# Altium schematic sheet PEAK——LCW (1).SchDoc
size A2
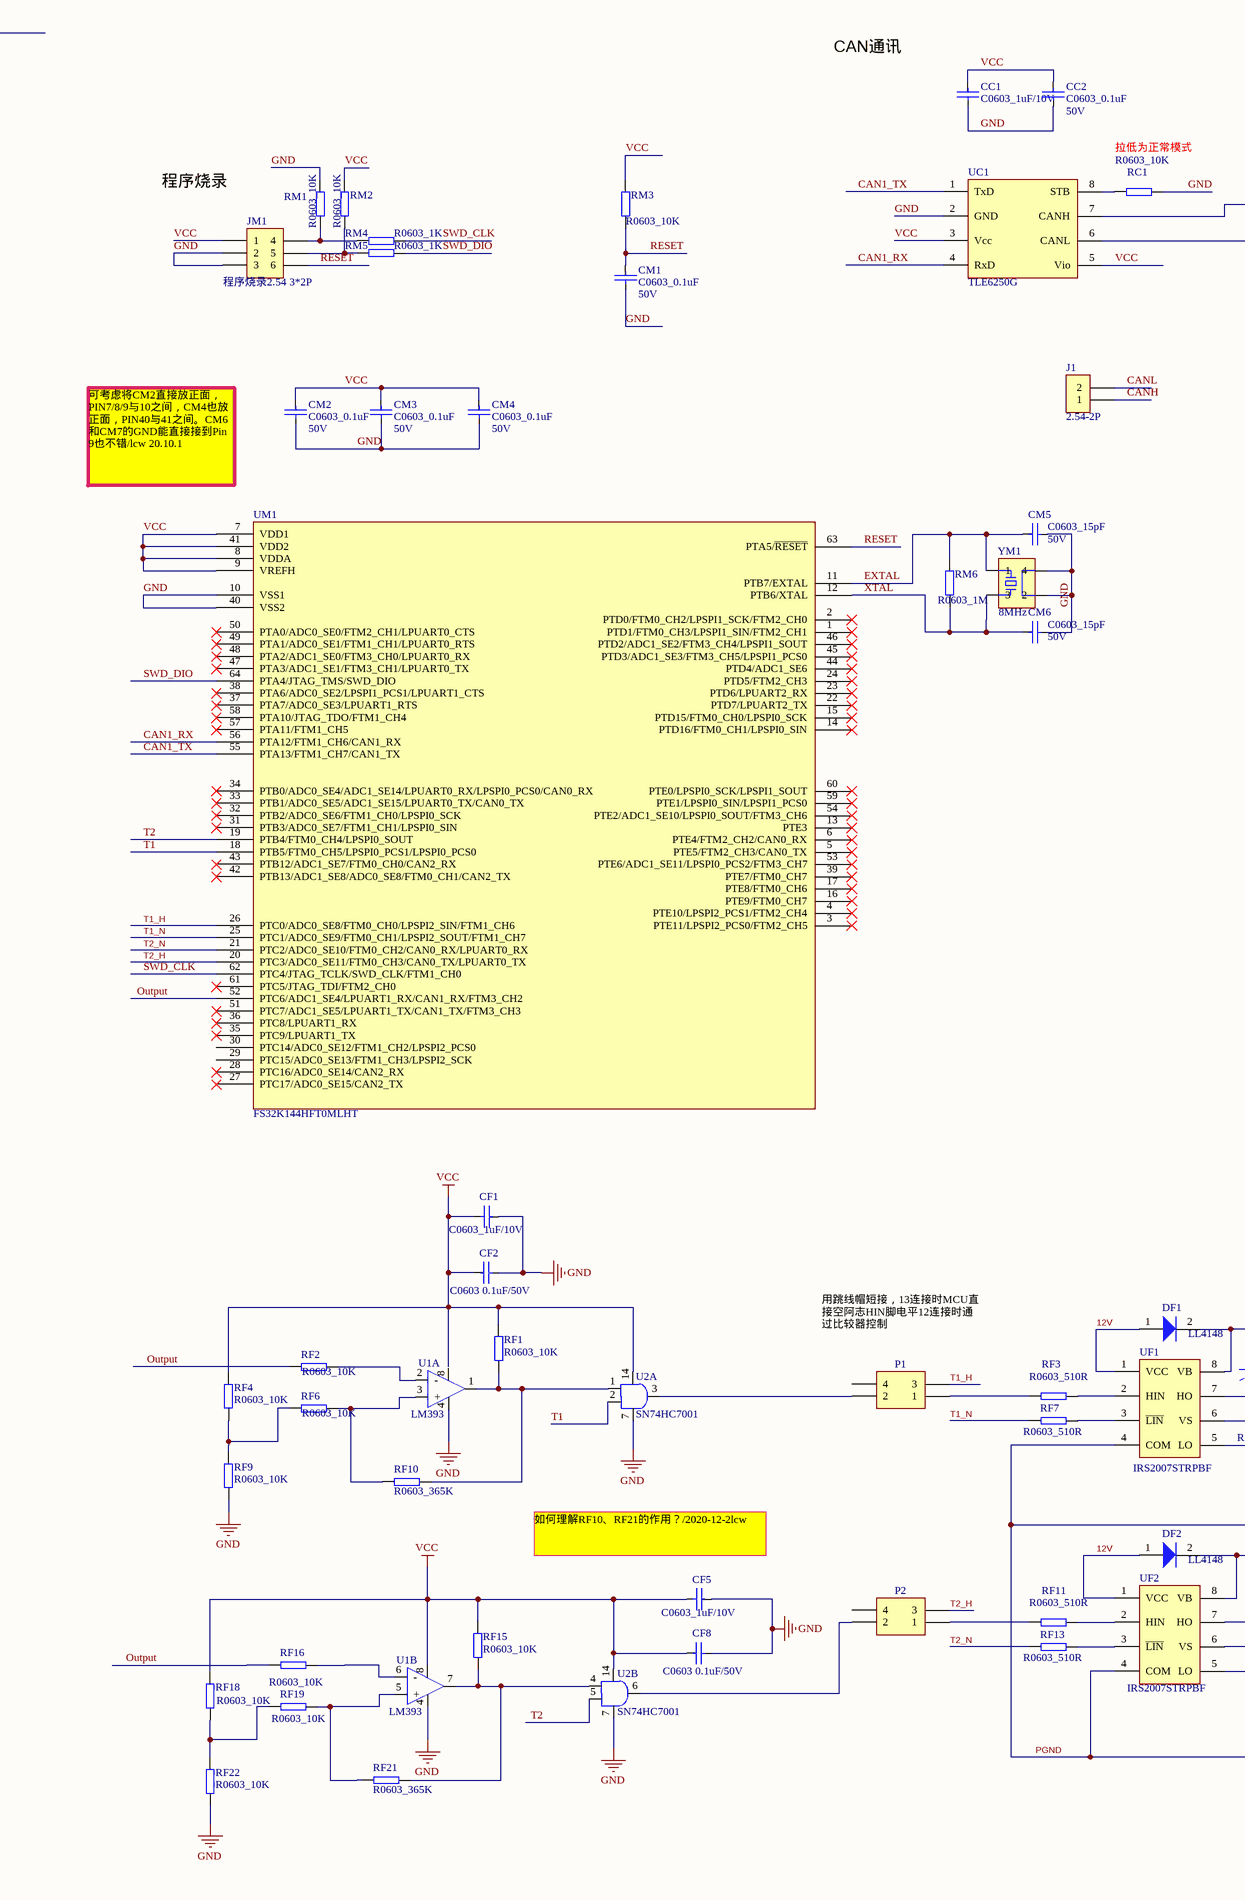
[diagram p0: PEAK——LCW (1).SchDoc, left]
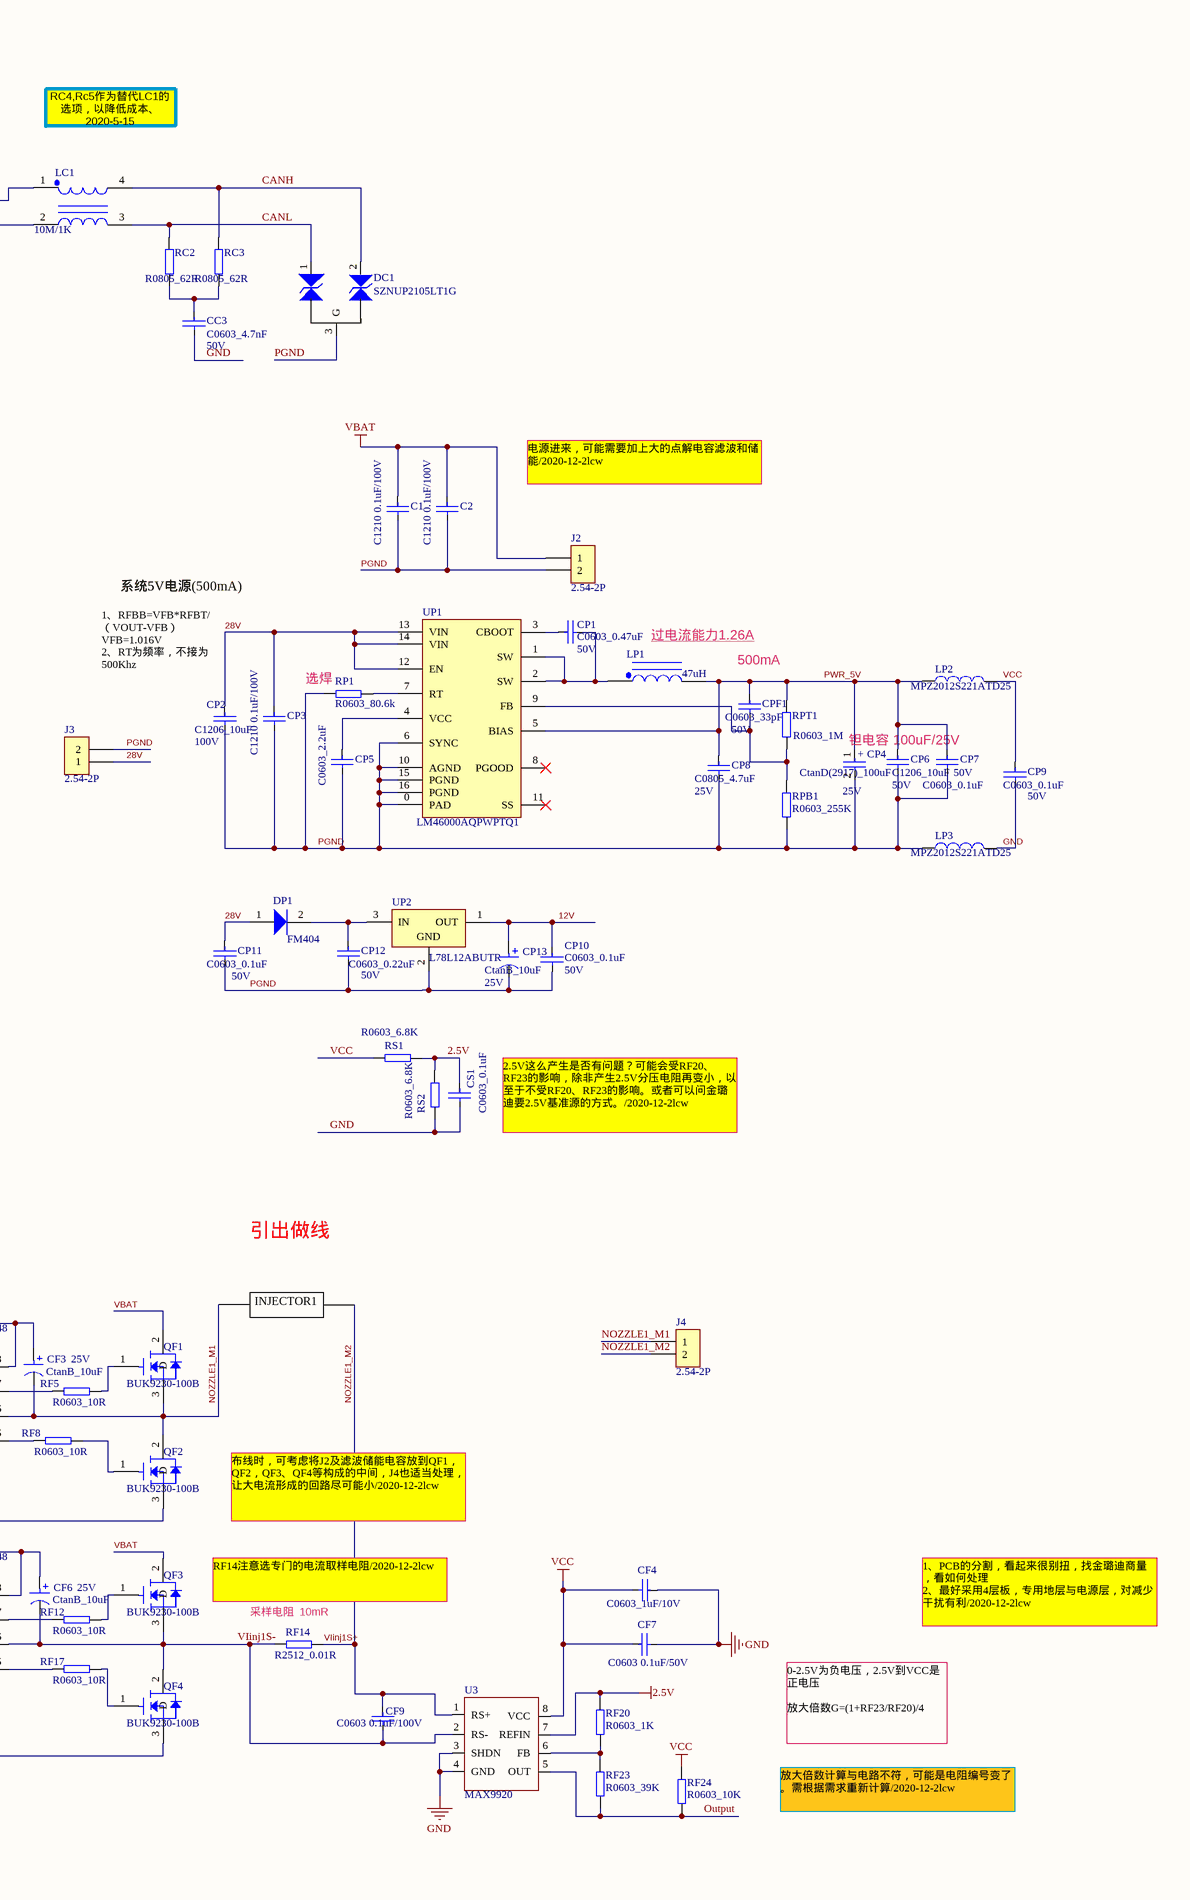
[diagram p1: PEAK——LCW (1).SchDoc, right]

## Parts
C1  C1210 0.1uF/100V  [C1210]
C2  C1210 0.1uF/100V  [C1210]
CC1  C0603_1uF/10V  [C0603]
CC2  Voltage: 50V  [C0603]  (hidden comment: C0603_0.1uF)
CC3  Voltage: 50V  [C0603]  (hidden comment: C0603_4.7nF)
CF1  C0603_1uF/10V  [C0603]
CF2  C0603 0.1uF/50V  [C0603]
CF3  Voltage: 25V  [CTANB]  (hidden comment: CtanB_10uF)
CF4  C0603_1uF/10V  [C0603]
CF5  C0603_1uF/10V  [C0603]
CF6  Voltage: 25V  [CTANB]  (hidden comment: CtanB_10uF)
CF7  C0603 0.1uF/50V  [C0603]
CF8  C0603 0.1uF/50V  [C0603]
CF9  C0603 0.1uF/100V  [C0603]
CM1  Voltage: 50V  [C0603]  (hidden comment: C0603_0.1uF)
CM2  Voltage: 50V  [C0603]  (hidden comment: C0603_0.1uF)
CM3  Voltage: 50V  [C0603]  (hidden comment: C0603_0.1uF)
CM4  Voltage: 50V  [C0603]  (hidden comment: C0603_0.1uF)
CM5  Voltage: 50V  [C0603]  (hidden comment: C0603_15pF)
CM6  Voltage: 50V  [C0603]  (hidden comment: C0603_15pF)
CP1  C0603_0.47uF  Voltage: 50V  [C0603]
CP2  C1206_10uF  Voltage: 100V  [C1206]
CP3  C1210 0.1uF/100V  [C1210]
CP4  Voltage: 25V  [CTAND]  (hidden comment: CtanD(2917)_100uF)
CP5  C0603_2.2uF  [C0603]
CP6  Voltage: 50V  [C1206]  (hidden comment: C1206_10uF)
CP7  Voltage: 50V  [C0603]  (hidden comment: C0603_0.1uF)
CP8  Voltage: 25V  [C0805]  (hidden comment: C0805_4.7uF)
CP9  Voltage: 50V  [C0603]  (hidden comment: C0603_0.1uF)
CP10  Voltage: 50V  [C0603]  (hidden comment: C0603_0.1uF)
CP11  Voltage: 50V  [C0603]  (hidden comment: C0603_0.1uF)
CP12  Voltage: 50V  [C0603]  (hidden comment: C0603_0.22uF)
CP13  Voltage: 25V  [CTANB]  (hidden comment: CtanB_10uF)
CPF1  Voltage: 50V  [C0603]  (hidden comment: C0603_33pF)
CS1  C0603_0.1uF  [C0603]
DC1  SZNUP2105LT1G  [SOT-23]
DF1  LL4148  [SOD-80]
DF2  LL4148  [SOD-80]
DP1  FM404  [D0-214AC]
J1  2.54-2P  [2.54-2P]
J2  2.54-2P  [2.54-2P]
J3  2.54-2P  [2.54-2P]
J4  2.54-2P  [2.54-2P]
JM1  程序烧录2.54 3*2P  [3x2P]
LC1  10M/1K  [ACT45B]
LP1  47uH  [LGK]
LP2  MPZ2012S221ATD25  [L 0805]
LP3  MPZ2012S221ATD25  [L 0805]
P1  Header 2X2  [HDR2X2]  (value not drawn)
P2  Header 2X2  [HDR2X2]  (value not drawn)
QF1  BUK9230-100B  [DPAK-3_L6.6-W6.1-P2.28-LS9.9-BR]
QF2  BUK9230-100B  [DPAK-3_L6.6-W6.1-P2.28-LS9.9-BR]
QF3  BUK9230-100B  [DPAK-3_L6.6-W6.1-P2.28-LS9.9-BR]
QF4  BUK9230-100B  [DPAK-3_L6.6-W6.1-P2.28-LS9.9-BR]
RC1  R0603_10K  [R0603]
RC2  R0805_62R  [R0805]
RC3  R0805_62R  [R0805]
RF1  R0603_10K  [R0603]
RF2  R0603_10K  [R0603]
RF3  R0603_510R  [R0603]
RF4  R0603_10K  [R0603]
RF5  R0603_10R  [R0603]
RF6  R0603_10K  [R0603]
RF7  R0603_510R  [R0603]
RF8  R0603_10R  [R0603]
RF9  R0603_10K  [R0603]
RF10  R0603_365K  [R0603]
RF11  R0603_510R  [R0603]
RF12  R0603_10R  [R0603]
RF13  R0603_510R  [R0603]
RF14  R2512_0.01R  [R2512]
RF15  R0603_10K  [R0603]
RF16  R0603_10K  [R0603]
RF17  R0603_10R  [R0603]
RF18  R0603_10K  [R0603]
RF19  R0603_10K  [R0603]
RF20  R0603_1K  [R0603]
RF21  R0603_365K  [R0603]
RF22  R0603_10K  [R0603]
RF23  R0603_39K  [R0603]
RF24  R0603_10K  [R0603]
RM1  R0603_10K  [R0603]
RM2  R0603_10K  [R0603]
RM3  R0603_10K  [R0603]
RM4  R0603_1K  [R0603]
RM5  R0603_1K  [R0603]
RM6  R0603_1M  [R0603]
RP1  R0603_80.6k  [R0603]
RPB1  R0603_255K  [R0603]
RPT1  R0603_1M  [R0603]
RS1  R0603_6.8K  [R0603]
RS2  R0603_6.8K  [R0603]
U1  LM393  [SOIC-8_L5.0-W4.0-P1.27-LS6.0-BL]  (parts A,B of 2)
U2  SN74HC7001  [SOIC-14_L8.7-W3.9-P1.27-LS6.0-BL]  (parts A,B of 2)
U3  MAX9920  [SOIC-8_L5.0-W4.0-P1.27-LS6.0-BL]
UC1  TLE6250G  [PG-DSO-8]
UF1  IRS2007STRPBF  [SOIC-8L]
UF2  IRS2007STRPBF  [SOIC-8L]
UM1  FS32K144HFT0MLHT  [LQFP-64]
UP1  LM46000AQPWPTQ1  [HTSSOP-16]
UP2  L78L12ABUTR  [SOT-89]
YM1  8MHz  [5.0*3.2_4]

## Nets
2.5V: CS1.1 RF20.2 RS1.1 RS2.2 U3.7(REFIN)
GND: CC1.2 CC2.2 CC3.2 CF1.1 CF2.2 CF4.1 CF5.1 CF7.2 CF8.2 CM1.2 CM2.2 CM3.2 CM4.2 CM5.2 CM6.2 CP9.2 CS1.2 JM1.2 JM1.3 LP3.2 RC1.2 RF9.1 RF22.1 RM1.2 RS2.1 U1.4 U2.7 U3.3(SHDN) U3.4(GND) UC1.2(GND) UM1.10(VSS1) UM1.40(VSS2) YM1.2 YM1.4
VBAT: C1.1 C2.1 J2.1 QF1.2(D) QF3.2(D)
VCC: CC1.1 CC2.1 CF1.2 CF2.1 CF4.2 CF5.2 CF7.1 CF8.1 CM2.1 CM3.1 CM4.1 CP9.1 JM1.1 LP2.2 RF1.1 RF4.2 RF15.2 RF18.2 RF24.2 RM2.2 RM3.2 RS1.2 U1.8 U2.14 U3.8(VCC) UC1.3(Vcc) UC1.5(Vio) UM1.7(VDD1) UM1.8(VDDA) UM1.9(VREFH) UM1.41(VDD2)
12V: CP10.1 CP13.1 DF1.1 DF2.1 UF1.1(VCC) UF2.1(VCC) UP2.1(OUT)
28V: CP2.1 CP3.1 CP11.1 DP1.1 J3.1 UP1.12(EN) UP1.13(VIN) UP1.14(VIN)
CAN1_RX: UC1.4(RxD) UM1.56(PTA12/FTM1_CH6/CAN1_RX)
CAN1_TX: UC1.1(TxD) UM1.55(PTA13/FTM1_CH7/CAN1_TX)
CANH: DC1.2 J1.1 LC1.4 RC3.2
CANL: DC1.1 J1.2 LC1.3 RC2.2
EXTAL: CM5.1 RM6.2 UM1.11(PTB7/EXTAL) YM1.1
NOZZLE1_M1: CF3.2 J4.1 QF1.3(S) QF2.2(D) UF1.6(VS)
NOZZLE1_M2: CF9.1 J4.2 RF14.2 U3.1(RS+)  [also labelled VIinj1S+]
Output: RF2.1 RF16.1 RF23.1 RF24.1 U3.5(OUT) UM1.52(PTC6/ADC1_SE4/LPUART1_RX/CAN1_RX/FTM3_CH2)
PGND: C1.2 C2.2 CP2.2 CP3.2 CP4.2 CP5.2 CP6.2 CP7.2 CP8.2 CP10.2 CP11.2 CP12.2 CP13.2 DC1.3(G) J2.2 J3.2 LP3.1 QF2.3(S) QF4.3(S) RP1.2 RPB1.1 UF1.4(COM) UF2.4(COM) UP1.0(PAD) UP1.6(SYNC) UP1.10(AGND) UP1.15(PGND) UP1.16(PGND) UP2.2(GND)
PWR_5V: CP4.1 CP6.1 CP7.1 CP8.1 CPF1.1 LP1.2 LP2.1 RPT1.2 UP1.5(BIAS)
RESET: CM1.1 JM1.6 RM3.1 UM1.63(PTA5/~{RESET})
SWD_CLK: RM4.2 UM1.62(PTC4/JTAG_TCLK/SWD_CLK/FTM1_CH0)
SWD_DIO: RM5.2 UM1.64(PTA4/JTAG_TMS/SWD_DIO)
T1: U2.2 UM1.18(PTB5/FTM0_CH5/LPSPI0_PCS1/LPSPI0_PCS0)
T1_H: P1.3 UM1.26(PTC0/ADC0_SE8/FTM0_CH0/LPSPI2_SIN/FTM1_CH6)
T1_N: RF7.1 UM1.25(PTC1/ADC0_SE9/FTM0_CH1/LPSPI2_SOUT/FTM1_CH7)
T2: U2.5 UM1.19(PTB4/FTM0_CH4/LPSPI0_SOUT)
T2_H: P2.3 UM1.20(PTC3/ADC0_SE11/FTM0_CH3/CAN0_TX/LPUART0_TX)
T2_N: RF13.1 UM1.21(PTC2/ADC0_SE10/FTM0_CH2/CAN0_RX/LPUART0_RX)
VIinj1S-: CF6.2 CF9.2 QF3.3(S) QF4.2(D) RF14.1 U3.2(RS-) UF2.6(VS)
XTAL: CM6.1 RM6.1 UM1.12(PTB6/XTAL) YM1.3
NetCC3_1: CC3.1 RC2.1 RC3.1
NetCF3_1: CF3.1 DF1.2 UF1.8(VB)
NetCF6_1: CF6.1 DF2.2 UF2.8(VB)
NetCP1_1: CP1.1 UP1.3(CBOOT)
NetCP1_2: CP1.2 LP1.1 UP1.1(SW) UP1.2(SW)
NetCP5_1: CP5.1 UP1.4(VCC)
NetCP12_1: CP12.1 DP1.2 UP2.3(IN)
NetCPF1_2: CPF1.2 RPB1.2 RPT1.1 UP1.9(FB)
NetJM1_4: JM1.4 RM1.1 RM4.1
NetJM1_5: JM1.5 RM2.1 RM5.1
NetLC1_1: LC1.1 UC1.7(CANH)
NetLC1_2: LC1.2 UC1.6(CANL)
NetP1_1: P1.1 RF3.1
NetP1_2: P1.2 U2.3
NetP2_1: P2.1 RF11.1
NetP2_2: P2.2 U2.6
NetQF1_1: QF1.1 RF5.2
NetQF2_1: QF2.1 RF8.2
NetQF3_1: QF3.1 RF12.2
NetQF4_1: QF4.1 RF17.2
NetRC1_1: RC1.1 UC1.8(STB)
NetRF1_2: RF1.2 RF10.2 U1.1 U2.1
NetRF2_2: RF2.2 U1.2(-)
NetRF3_2: RF3.2 UF1.2(HIN)
NetRF4_1: RF4.1 RF6.1 RF9.2
NetRF5_1: RF5.1 UF1.7(HO)
NetRF6_2: RF6.2 RF10.1 U1.3(+)
NetRF7_2: RF7.2 UF1.3(~{LIN})
NetRF8_1: RF8.1 UF1.5(LO)
NetRF11_2: RF11.2 UF2.2(HIN)
NetRF12_1: RF12.1 UF2.7(HO)
NetRF13_2: RF13.2 UF2.3(~{LIN})
NetRF15_1: RF15.1 RF21.2 U1.7 U2.4
NetRF16_2: RF16.2 U1.6(-)
NetRF17_1: RF17.1 UF2.5(LO)
NetRF18_1: RF18.1 RF19.1 RF22.2
NetRF19_2: RF19.2 RF21.1 U1.5(+)
NetRF20_1: RF20.1 RF23.2 U3.6(FB)
NetRP1_1: RP1.1 UP1.7(RT)

Not connected (* = marked no-connect by the designer): P1 4; P2 4; UM1 1(PTD1/FTM0_CH3/LPSPI1_SIN/FTM2_CH1)* 2(PTD0/FTM0_CH2/LPSPI1_SCK/FTM2_CH0)* 3(PTE11/LPSPI2_PCS0/FTM2_CH5)* 4(PTE10/LPSPI2_PCS1/FTM2_CH4)* 5(PTE5/FTM2_CH3/CAN0_TX)* 6(PTE4/FTM2_CH2/CAN0_RX)* 13(PTE3)* 14(PTD16/FTM0_CH1/LPSPI0_SIN)* 15(PTD15/FTM0_CH0/LPSPI0_SCK)* 16(PTE9/FTM0_CH7)* 17(PTE8/FTM0_CH6)* 22(PTD7/LPUART2_TX)* 23(PTD6/LPUART2_RX)* 24(PTD5/FTM2_CH3)* 27(PTC17/ADC0_SE15/CAN2_TX)* 28(PTC16/ADC0_SE14/CAN2_RX)* 29(PTC15/ADC0_SE13/FTM1_CH3/LPSPI2_SCK) 30(PTC14/ADC0_SE12/FTM1_CH2/LPSPI2_PCS0) 31(PTB3/ADC0_SE7/FTM1_CH1/LPSPI0_SIN)* 32(PTB2/ADC0_SE6/FTM1_CH0/LPSPI0_SCK)* 33(PTB1/ADC0_SE5/ADC1_SE15/LPUART0_TX/CAN0_TX)* 34(PTB0/ADC0_SE4/ADC1_SE14/LPUART0_RX/LPSPI0_PCS0/CAN0_RX)* 35(PTC9/LPUART1_TX)* 36(PTC8/LPUART1_RX)* 37(PTA7/ADC0_SE3/LPUART1_RTS)* 38(PTA6/ADC0_SE2/LPSPI1_PCS1/LPUART1_CTS)* 39(PTE7/FTM0_CH7)* 42(PTB13/ADC1_SE8/ADC0_SE8/FTM0_CH1/CAN2_TX)* 43(PTB12/ADC1_SE7/FTM0_CH0/CAN2_RX)* 44(PTD4/ADC1_SE6)* 45(PTD3/ADC1_SE3/FTM3_CH5/LPSPI1_PCS0)* 46(PTD2/ADC1_SE2/FTM3_CH4/LPSPI1_SOUT)* 47(PTA3/ADC1_SE1/FTM3_CH1/LPUART0_TX)* 48(PTA2/ADC1_SE0/FTM3_CH0/LPUART0_RX)* 49(PTA1/ADC0_SE1/FTM1_CH1/LPUART0_RTS)* 50(PTA0/ADC0_SE0/FTM2_CH1/LPUART0_CTS)* 51(PTC7/ADC1_SE5/LPUART1_TX/CAN1_TX/FTM3_CH3)* 53(PTE6/ADC1_SE11/LPSPI0_PCS2/FTM3_CH7)* 54(PTE2/ADC1_SE10/LPSPI0_SOUT/FTM3_CH6)* 57(PTA11/FTM1_CH5)* 58(PTA10/JTAG_TDO/FTM1_CH4)* 59(PTE1/LPSPI0_SIN/LPSPI1_PCS0)* 60(PTE0/LPSPI0_SCK/LPSPI1_SOUT)* 61(PTC5/JTAG_TDI/FTM2_CH0)*; UP1 8(PGOOD)* 11(SS)*

## Notes on the sheet
- CAN通讯
- 拉低为正常模式
- RC4,Rc5作为替代LC1的选项，以降低成本、2020-5-15
- 程序烧录
- 可考虑将CM2直接放正面，PIN7/8/9与10之间，CM4也放正面，PIN40与41之间。CM6和CM7的GND能直接接到Pin 9也不错/lcw 20.10.1
- 电源进来，可能需要加上大的点解电容滤波和储能/2020-12-2lcw
- 系统5V电源
- 系统5V电源(500mA)
- (near CP2) 1、RFBB=VFB*RFBT/（VOUT-VFB）
  VFB=1.016V
  2、RT为频率，不接为500Khz
- (near RP1) 选焊
- (near LP1) 过电流能力1.26A
- 500mA
- 钽电容 100uF/25V
- 2.5V这么产生是否有问题？可能会受RF20、RF23的影响，除非产生2.5V分压电阻再变小，以至于不受RF20、RF23的影响。或者可以问金璐迪要2.5V基准源的方式。/2020-12-2lcw
- 引出做线
- INJECTOR1
- (near P1) 用跳线帽短接，13连接时MCU直接空阿志HIN脚电平12连接时通过比较器控制
- (near CF5) 如何理解RF10、RF21的作用？/2020-12-2lcw
- 布线时，可考虑将J2及滤波储能电容放到QF1，QF2，QF3、QF4等构成的中间，J4也适当处理，让大电流形成的回路尽可能小/2020-12-2lcw
- RF14注意选专门的电流取样电阻/2020-12-2lcw
- (near RF14) 采样电阻
- (near RF14) 10mR
- 1、PCB的分割，看起来很别扭，找金璐迪商量，看如何处理
  2、最好采用4层板，专用地层与电源层，对减少干扰有利/2020-12-2lcw
- 0-2.5V为负电压，2.5V到VCC是正电压
  放大倍数G=(1+RF23/RF20)/4
- 放大倍数计算与电路不符，可能是电阻编号变了。需根据需求重新计算/2020-12-2lcw
- (in symbol 3170030004) +

## Library data of the parts
C1 C2 = 3170014005: C1210 0.1uF/50V 10%; Part Number1: 03172540005; Manufacturer: YAGEO; Manufacture no: CC1210KRX7R9BB104; Voltage: 100V; Tolerance: 0.1; Type: 贴片电容; Part Number: 3170014005; Value: C1210 0.1uF/100V
CC1 CF1 CF4 CF5 = 3170011015: C0603 0.1uF/50V 10%; Part Number1: 03172510014; Manufacturer: YAGEO; Manufacture no: CC0603KRX7R9BB104; Voltage: 10V; Tolerance: 0.1; Part Number: 3170011015; Value: C0603_1uF/10V; Price: 0.0079; Status: 凯而高; Type: 贴片电容
CC2 CM1-CM4 CP7 CP9 CP11 = 3170011015: C0603 0.1uF/50V 10%; Part Number1: 03172510014; Manufacturer: YAGEO; Manufacture no: CC0603KRX7R9BB104; Tolerance: 0.1; Part Number: 3170011015; Value: C0603_0.1uF; Price: 0.0079; Status: 凯而高; Type: 贴片电容
CC3 = 3170011009: C0603 4.7nF/50V 5% X7R; Part Number1: 03172410008; Manufacturer: YAGEO; Manufacture no: CC0603JRX7R9BB472; Tolerance: 0.1; Part Number: 3170011009; Value: C0603_4.7nF; Price: 0.012; Type: 贴片电容
CF2 CF7-CF9 CS1 = 3170011015: C0603 0.1uF/50V 10%; Part Number1: 03172510014; Manufacturer: YAGEO; Manufacture no: CC0603KRX7R9BB104; Voltage: 50V; Tolerance: 0.1; Part Number: 3170011015; Price: 0.0079; Status: 凯而高; Type: 贴片电容
  CF2 CF7 CF8: Value: C0603 0.1uF/50V
  CF9: Value: C0603 0.1uF/100V
  CS1: Value: C0603_0.1uF
CF3 CF6 CP13 = 3172690034: CtanB(1210) 10uF/25V 10%; Part Number1: 03172690034; Manufacturer: AVX; Manufacture no: TAJB106K025RNJ; Tolerance: 0.1; Part Number: 3172690034; Value: CtanB_10uF; Type: 钽电容
CM5 CM6 = 3172510040: C0603 15pF/50V 10%; Part Number1: 03172510040; Manufacturer: YAGEO; Tolerance: 0.1; Part Number: 3172510040; Value: C0603_15pF; Type: 贴片电容
CP1 = 3170011017: C0603 0.47uF/50V 10%; Part Number1: 03172510016; Manufacturer: murata; Manufacture no: GRM188R61H474KA12D; Tolerance: 0.1; Part Number: 3170011017; Value: C0603_0.47uF; Price: 0.0012; Type: 贴片电容
CP2 CP6 = 3172530019: C1206 10uF/50V  10%; Part Number1: 03172530019; Manufacturer: YAGEO; Tolerance: 0.1; Part Number: 3172530019; Value: C1206_10uF; Type: 贴片电容
CP3 = 3170014005: C1210 0.1uF/100V 10%; Part Number1: 03172540005; Manufacturer: YAGEO; Manufacture no: CC1210KRX7R9BB104; Voltage: 100V; Tolerance: 0.1; Part Number: 3170014005; Value: C1210 0.1uF/100V; Type: 贴片电容
CP4 = 3170030004: CtanD(2917) 100uF/25V 10%; Part Number1: 03172690019; Manufacturer: AVX; Manufacture no: TAJD107K025RNJ; Tolerance: 0.1; Part Number: 3170030004; Value: CtanD(2917)_100uF; Price: 0.28; Type: 钽电容
CP5 = 3170011030: C0603 2.2uF/50V 10%; Part Number1: 03172510027; Manufacturer: YAGEO; Manufacture no: CC0603KRX5R9BB225; Voltage: 50V; Tolerance: 0.1; Part Number: 3170011030; Value: C0603_2.2uF; Type: 贴片电容
CP8 = 3170012010: C0805 4.7uF/25V 10%; Part Number1: 03172520010; Manufacturer: YAGEO; Manufacture no: CC0805KRX5R8BB475; Tolerance: 0.1; Part Number: 3170012010; Value: C0805_4.7uF; Price: 0.012; Type: 贴片电容
CP10 = 3170011015: C0603 0.1uF/50V 10%  X7R; Part Number1: 03172510014; Manufacturer: YAGEO; Manufacture no: CC0603KRX7R9BB104; Tolerance: 0.1; Part Number: 3170011015; Value: C0603_0.1uF; Price: 0.0079; Status: 凯而高; Type: 贴片电容
CP12 = 3172510028: C0603 0.22uF/50V 10%; Part Number1: 03172510028; Manufacturer: YAGEO; Tolerance: 0.1; Part Number: 3172510028; Value: C0603_0.22uF; Type: 贴片电容
CPF1 = 3172510041: C0603 33pF/50V 10%; Part Number1: 03172510041; Manufacturer: YAGEO; Tolerance: 0.1; Part Number: 3172510041; Value: C0603_33pF; Type: 贴片电容
DC1 = 3110050073: SOT-23 SZNUP2105LT1G; Part Number1: 03110050073; Manufacturer: ON; ProductNumber: GSOT08C/Vishay; Voltage: 24V; Power: 350W; Part Number: 3110050073; Manufacture no: SZNUP2105LT1G; Value: SZNUP2105LT1G; Status: Active; Type: CAN保护TVS
DF1 DF2 = 3110010015: SOD-80  LL4148 2A/75V; Part Number1: 03110010015; Manufacturer: VISHA; Current: 2A; Voltage: 75V; Part Number: 3110010015; Manufacture no: LL4148; Value: LL4148; Status: Active; Type: SWH DIODE
DP1 = 13110010013: D0-214AC FM404; Part Number1: 53110010013; Manufacturer: LRC; Current: 1A; Voltage: 400V; Part Number: 13110010013; Manufacture no: FM404; Value: FM404; Status: Active; Type: 二极管
J1-J4 = 53190010200: Manufacture no: 单排插针 2.54MM 2P; Part Number: 53190010200; Part Number1: 53190010200; Value: 2.54-2P; Status: Active; Type: 接插件
JM1 = 53190010221: Part Number: 53190010221; Part Number1: 53190010221; Manufacture no: 程序烧录2.54 3*2P; Value: 程序烧录2.54 3*2P; Status: Active; Type: 程序烧录直针
LC1 = 3180020022: ACT45B-510-2P-TL  10M/1K/0.2A; Part Number1: 03180020022; Manufacturer: TDK; Current: 0.2A; Tolerance: 20%; DCR: 1R; Part Number: 3180020022; Manufacture no: ACT45B-510-2P-TL; Value: 10M/1K; Status: Active; Type: SIGNAL COMMON INDUCTOR
LP1 = 53180020033: CLF7045NIT-470M-D  47uH/1.26A  Q; Manufacturer: TDK; Current: 1.26A; Tolerance: 20%; DCR: 0.097R; Part Number: 53180020033; Part Number1: 53180020033; Manufacture no: CLF7045NIT-470M-D; Value: 47uH; Status: Active; Type: INDUCTOR
LP2 LP3 = 53180020011: L0805 MPZ2012S221ATD25; Manufacturer: TDK; Current: 3A; Tolerance: 25%; DCR: 0.04Ω; Part Number: 53180020011; Part Number1: 53180020011; Manufacture no: MPZ2012S221ATD25; Value: MPZ2012S221ATD25; Type: INDUCTOR
P1 P2 = Header 2X2: Header, 2-Pin, Dual row; LatestRevisionDate: 17-Jul-2002; LatestRevisionNote: Re-released for DXP Platform.; Publisher: Altium Limited
QF1-QF4 = 53110022012: TO-252-3 FDD86567-F085 60V/100A; Manufacturer: ON; Current: 100A; Voltage: 60V; DCR: 3.2mR; Part Number: 53110022012; Part Number1: 53110022012; Manufacture no: FDD86567-F085; Value: BUK9230-100B; Status: Active; Type: FET-N
RC1 RF1 RF2 RF4 RF6 RF9 RF15 RF16 RF18 RF19 RF22 RF24 RM1-RM3 = 3160030053: R0603 1/10w 10K 1%; Part Number1: 03162310053; Manufacturer: YAGEO; Manufacture no: RC0603FR-0710KL; Tolerance: 0.01; Part Number: 3160030053; Value: R0603_10K; Power: 1/10w; Unit Price: 0.0054; Status: 杭州，晶电; Type: 贴片电阻
RC2 RC3 = 3160050016: R0805 1/8w10R 1%; Part Number1: 03162320016; Manufacturer: YAGEO; Manufacture no: RC0805FR-0710RL; Power: 1/8w; Tolerance: 0.01; Part Number: 3160050016; Value: R0805_62R; Type: 贴片电阻
RF3 RF7 RF11 RF13 = 3160030020: R0603  1/10w 510R 1%; Part Number1: 03162310020; Manufacturer: YAGEO; Manufacture no: RC0603FR-07510RL; Tolerance: 0.01; Part Number: 3160030020; Value: R0603_510R; Power: 1/10w; Unit Price: 0.0054; Type: 贴片电阻
RF5 RF8 RF12 RF17 = 3160030193: R0603 1/10w  10R 1%; Part Number1: 03162310193; Manufacturer: YAGEO; Manufacture no: RC0603FR-0710RL; Tolerance: 0.01; Part Number: 3160030193; Value: R0603_10R; Power: 1/10w; Type: 贴片电阻
RF10 RF21 = 3160030166: R0603 1/10w 365K 1%; Part Number1: 03162310166; Manufacturer: YAGEO; Manufacture no: RC0603FR-07365KL; Tolerance: 0.01; Part Number: 3160030166; Value: R0603_365K; Power: 1/10w; Unit Price: 0.0054; Type: 贴片电阻
RF14 = 3162380033: R2512 1W 0.01R 1%; Part Number1: 03162380033; Manufacturer: YAGEO; Tolerance: 0.01; Part Number: 3162380033; Value: R2512_0.01R; Power: 1W; Type: 贴片电阻
RF20 RM4 RM5 = 3160030021: R0603  1/10w 1K 1%; Part Number1: 03162310021; Manufacturer: YAGEO; Manufacture no: RC0603FR-071KL; Tolerance: 0.01; Part Number: 3160030021; Value: R0603_1K; Power: 1/10w; Unit Price: 0.0054; Status: 杭州，晶电; Type: 贴片电阻
RF23 = 3160030165: R0603 1/10w 39K 1%; Part Number1: 03162310165; Manufacturer: YAGEO/UNIOHM; Manufacture no: RC0603FR-07360KL; Tolerance: 0.01; Part Number: 3160030165; Value: R0603_39K; Power: 1/10w; Unit Price: 0.0054; Type: 贴片电阻
RM6 RPT1 = 3160030183: R0603 1/10w 1M 1%; Part Number1: 03162310183; Manufacturer: YAGEO/UNIOHM; Manufacture no: RC0603FR-071ML; Tolerance: 0.01; Part Number: 3160030183; Value: R0603_1M; Power: 1/10w; Unit Price: 0.0054; Status: 杭州，晶电; Type: 贴片电阻
RP1 = 3162310230: R0603 1/10w 80.6k 1%; Part Number1: 03162310230; Manufacturer: YAGEO; Manufacture no: RC0603FR-0780K6L; Tolerance: 0.01; Part Number: 3162310230; Value: R0603_80.6k; Power: 1/10w; Type: 贴片电阻
RPB1 = 3160030153: R0603 1/10w255K 1%; Part Number1: 03162310153; Manufacturer: YAGEO; Manufacture no: RC0603FR-07225KL; Power: 1/10w; Tolerance: 0.01; Part Number: 3160030153; Value: R0603_255K; Unit Price: 0.0054; Type: 贴片电阻
RS1 = 3160030047: R0603 1/10w 6.8K; Part Number1: 03162310047; Manufacturer: YAGEO; Manufacture no: RC0603FR-076K8L; Tolerance: 0.01; Part Number: 3160030047; Value: R0603_6.8K; Power: 1/10w; Unit Price: 0.0054; Type: 贴片电阻
RS2 = 3160030031: R0603  1/10w 2.4K; Part Number1: 03162310031; Manufacturer: YAGEO; Manufacture no: RC0603FR-072K4L; Tolerance: 0.01; Part Number: 3160030031; Value: R0603_6.8K; Power: 1/10w; Unit Price: 0.0054; Type: 贴片电阻
UC1 = 3100050124: PG-DSO-8 TLE9251VSJ; Part Number1: 03100050124; Manufacturer: infineon; Part Number: 3100050124; Manufacture no: TLE9251VSJ; Value: TLE6250G; Type: CAN芯片
UF1 UF2 = 3100050121: SOIC-8L IRS2007STRPBF; Part Number1: 03100050121; Manufacturer: infineon; Part Number: 3100050121; Manufacture no: IRS2007STRPBF; Value: IRS2007STRPBF; Type: 半桥驱动芯片
UM1 = 3100010021: LQFP-64 FS32K144HFT0MLHT; Part Number1: 03100010021; Manufacturer: NXP; ProductNumber: STM32L105RBT6; Part Number: 3100010021; Manufacture no: FS32K144HFT0MLHT; Value: FS32K144HFT0MLHT; Type: MCU
UP1 = 3100050127: HTSSOP-16 LM46000AQPWPTQ1 60V/0.5A降压  Q; Part Number1: 03100050127; Manufacturer: TI; Part Number: 3100050127; Manufacture no: LM46000AQPWPTQ1; Value: LM46000AQPWPTQ1; Type: DCDC芯片
UP2 = 3100050105: SOT-89 L78L12ABUTR; Part Number1: 03100050105; Manufacturer: ST; Part Number: 3100050105; Manufacture no: L78L12ABUTR; Value: L78L12ABUTR; Type: LDO芯片
YM1 = 53120010026: 5.0*3.2  8MHz 15pF; Manufacturer: HKC; Part Number: 53120010026; Part Number1: 53120010026; Manufacture no: 8MHz; Value: 8MHz; Status: Active; Type: 晶振